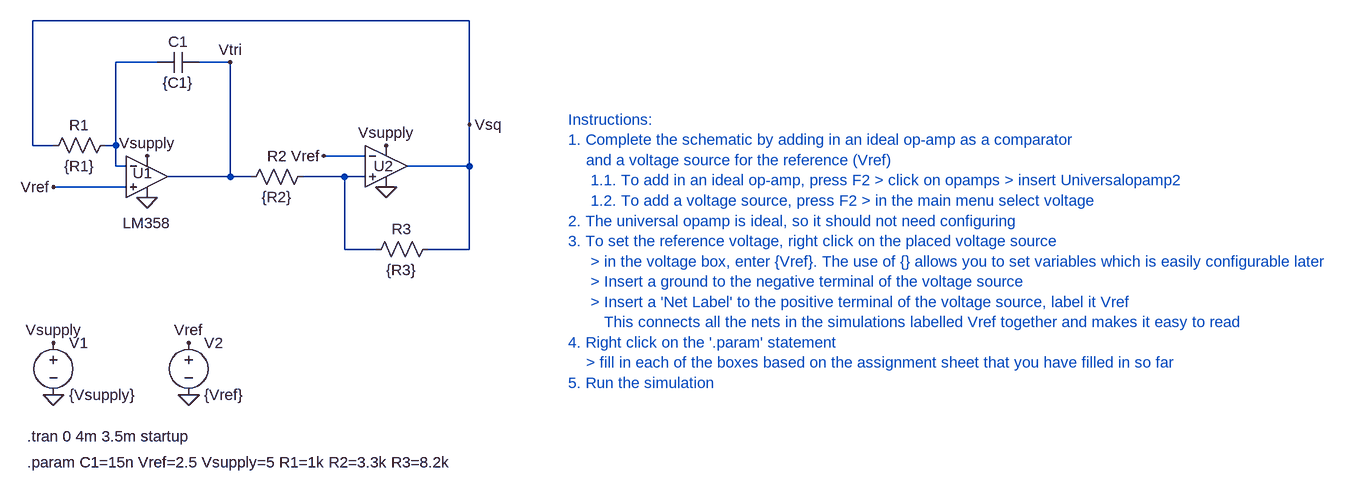
[diagram p0: schematic Assignment1_Task2_2_Ideal.asc]
Assignment1_Task2_2_Ideal.asc, the LTspice schematic file:
Version 4
SHEET 1 4884 1040
WIRE 352 -224 -320 -224
WIRE -128 -160 -192 -160
WIRE -16 -160 -64 -160
WIRE 352 -64 352 -224
WIRE -320 -32 -320 -224
WIRE -288 -32 -320 -32
WIRE -192 -32 -192 -160
WIRE -192 -32 -208 -32
WIRE 192 -16 128 -16
WIRE -192 0 -192 -32
WIRE -176 0 -192 0
WIRE 352 0 352 -64
WIRE 352 0 256 0
WIRE -16 16 -16 -160
WIRE -16 16 -112 16
WIRE 16 16 -16 16
WIRE 160 16 96 16
WIRE 192 16 160 16
WIRE -176 32 -288 32
WIRE 160 128 160 16
WIRE 208 128 160 128
WIRE 352 128 352 0
WIRE 352 128 288 128
FLAG -288 352 0
FLAG -288 272 Vsupply
FLAG -16 -160 Vtri
FLAG 224 32 0
FLAG -144 48 0
FLAG -288 32 Vref
FLAG 128 -16 Vref
FLAG 352 -64 Vsq
FLAG -144 -16 Vsupply
FLAG 224 -32 Vsupply
FLAG -80 272 Vref
FLAG -80 352 0
SYMBOL voltage -288 256 R0
WINDOW 123 0 0 Left 0
WINDOW 39 0 0 Left 0
SYMATTR InstName V1
SYMATTR Value {Vsupply}
SYMBOL res -192 -48 R90
WINDOW 0 0 56 VBottom 2
WINDOW 3 32 56 VTop 2
SYMATTR InstName R1
SYMATTR Value {R1}
SYMBOL cap -64 -176 R90
WINDOW 0 0 32 VBottom 2
WINDOW 3 32 32 VTop 2
SYMATTR InstName C1
SYMATTR Value {C1}
SYMATTR SpiceLine Rser=10m
SYMBOL res 112 0 R90
WINDOW 0 0 56 VBottom 2
WINDOW 3 32 56 VTop 2
SYMATTR InstName R2
SYMATTR Value {R2}
SYMBOL res 304 112 R90
WINDOW 0 0 56 VBottom 2
WINDOW 3 32 56 VTop 2
SYMATTR InstName R3
SYMATTR Value {R3}
SYMBOL OpAmps\\UniversalOpAmp2 224 0 R0
WINDOW 0 -19 0 Left 2
SYMATTR InstName U2
SYMATTR Value2 Avol=1Meg GBW=10Meg Slew=10000Meg
SYMBOL voltage -80 256 R0
WINDOW 123 0 0 Left 0
WINDOW 39 0 0 Left 0
SYMATTR InstName V2
SYMATTR Value {Vref}
SYMBOL AutoGenerated\\LM358 -144 16 R0
WINDOW 0 -7 10 Bottom 2
WINDOW 3 0 56 Top 2
SYMATTR InstName U1
SYMATTR Value LM358
TEXT -328 416 Left 2 !.tran 0 4m 3.5m startup
TEXT -328 456 Left 2 !.param C1=15n Vref=2.5 Vsupply=5 R1=1k R2=3.3k R3=8.2k
TEXT 504 -72 Left 2 ;Instructions:\n1. Complete the schematic by adding in an ideal op-amp as a comparator\n    and a voltage source for the reference (Vref)\n     1.1. To add in an ideal op-amp, press F2 > click on opamps > insert Universalopamp2\n     1.2. To add a voltage source, press F2 > in the main menu select voltage\n2. The universal opamp is ideal, so it should not need configuring\n3. To set the reference voltage, right click on the placed voltage source \n     > in the voltage box, enter {Vref}. The use of {} allows you to set variables which is easily configurable later\n     > Insert a ground to the negative terminal of the voltage source\n     > Insert a 'Net Label' to the positive terminal of the voltage source, label it Vref\n        This connects all the nets in the simulations labelled Vref together and makes it easy to read\n4. Right click on the '.param' statement\n    > fill in each of the boxes based on the assignment sheet that you have filled in so far\n5. Run the simulation

The netlist it stands for:
* Assignment1_Task2_2_Ideal.asc
V1 Vsupply 0 {Vsupply}
R1 N001 Vsq {R1}
C1 Vtri N001 {C1} Rser=10m
R2 N002 Vtri {R2}
R3 Vsq N002 {R3}
XU2 N002 Vref Vsupply 0 Vsq level2 Avol=1Meg GBW=10Meg Slew=10000Meg Ilimit=25m Rail=0 Vos=0 En=0 Enk=0 In=0 Ink=0 Rin=500Meg  ; pins In+ In- V+ V- OUT
V2 Vref 0 {Vref}
* U1: LM358 (symbol AutoGenerated\LM358 not available, pins judged from their places): In+=Vref In-=N001 V+=Vsupply V-=0 OUT=Vtri
.tran 0 4m 3.5m startup
.param C1=15n Vref=2.5 Vsupply=5 R1=1k R2=3.3k R3=8.2k
* Instructions:
* 1. Complete the schematic by adding in an ideal op-amp as a comparator
*     and a voltage source for the reference (Vref)
*      1.1. To add in an ideal op-amp, press F2 > click on opamps > insert Universalopamp2
*      1.2. To add a voltage source, press F2 > in the main menu select voltage
* 2. The universal opamp is ideal, so it should not need configuring
* 3. To set the reference voltage, right click on the placed voltage source
*      > in the voltage box, enter {Vref}. The use of {} allows you to set variables which is easily configurable later
*      > Insert a ground to the negative terminal of the voltage source
*      > Insert a 'Net Label' to the positive terminal of the voltage source, label it Vref
*         This connects all the nets in the simulations labelled Vref together and makes it easy to read
* 4. Right click on the '.param' statement
*     > fill in each of the boxes based on the assignment sheet that you have filled in so far
* 5. Run the simulation
.lib UniversalOpAmp2.lib
.backanno
.end